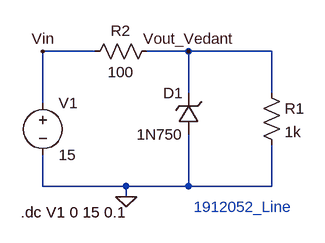
[diagram p0: schematic Draft24.asc]
Draft24.asc, the LTspice schematic file:
Version 4
SHEET 1 880 680
WIRE 144 48 64 48
WIRE 288 48 224 48
WIRE 416 48 288 48
WIRE 288 112 288 48
WIRE 416 112 416 48
WIRE 64 128 64 48
WIRE 64 256 64 208
WIRE 192 256 64 256
WIRE 288 256 288 176
WIRE 288 256 192 256
WIRE 416 256 416 192
WIRE 416 256 288 256
WIRE 192 272 192 256
FLAG 192 272 0
FLAG 288 48 Vout_Vedant
FLAG 64 48 Vin
SYMBOL voltage 64 112 R0
WINDOW 123 0 0 Left 0
WINDOW 39 0 0 Left 0
SYMATTR InstName V1
SYMATTR Value 15
SYMBOL res 400 96 R0
SYMATTR InstName R1
SYMATTR Value 1k
SYMBOL res 240 32 R90
WINDOW 0 0 56 VBottom 2
WINDOW 3 32 56 VTop 2
SYMATTR InstName R2
SYMATTR Value 100
SYMBOL zener 304 176 R180
WINDOW 0 24 64 Left 2
WINDOW 3 24 0 Left 2
SYMATTR InstName D1
SYMATTR Value 1N750
SYMATTR Description Diode
SYMATTR Type diode
TEXT 30 296 Left 2 !.dc V1 0 15 0.1
TEXT 296 288 Left 2 ;1912052_Line

The netlist it stands for:
* Draft24.asc
V1 Vin 0 15
R1 Vout_Vedant 0 1k
R2 Vout_Vedant Vin 100
D1 0 Vout_Vedant 1N750
.model D D
.lib standard.dio
.dc V1 0 15 0.1
* 1912052_Line
.backanno
.end